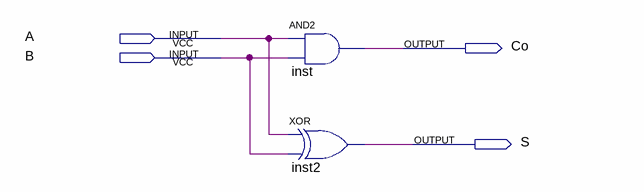
[diagram p0: schematic sheet]
// Quartus schematic arch.bdf as structural Verilog: 2 symbols, 4 pins
module arch (
  input  A,
  input  B,
  output Co,
  output S
);

  and inst (Co, A, B);
  xor inst2 (S, A, B);
endmodule
